# EAGLE schematic hometech++ (EAGLE 5.11)
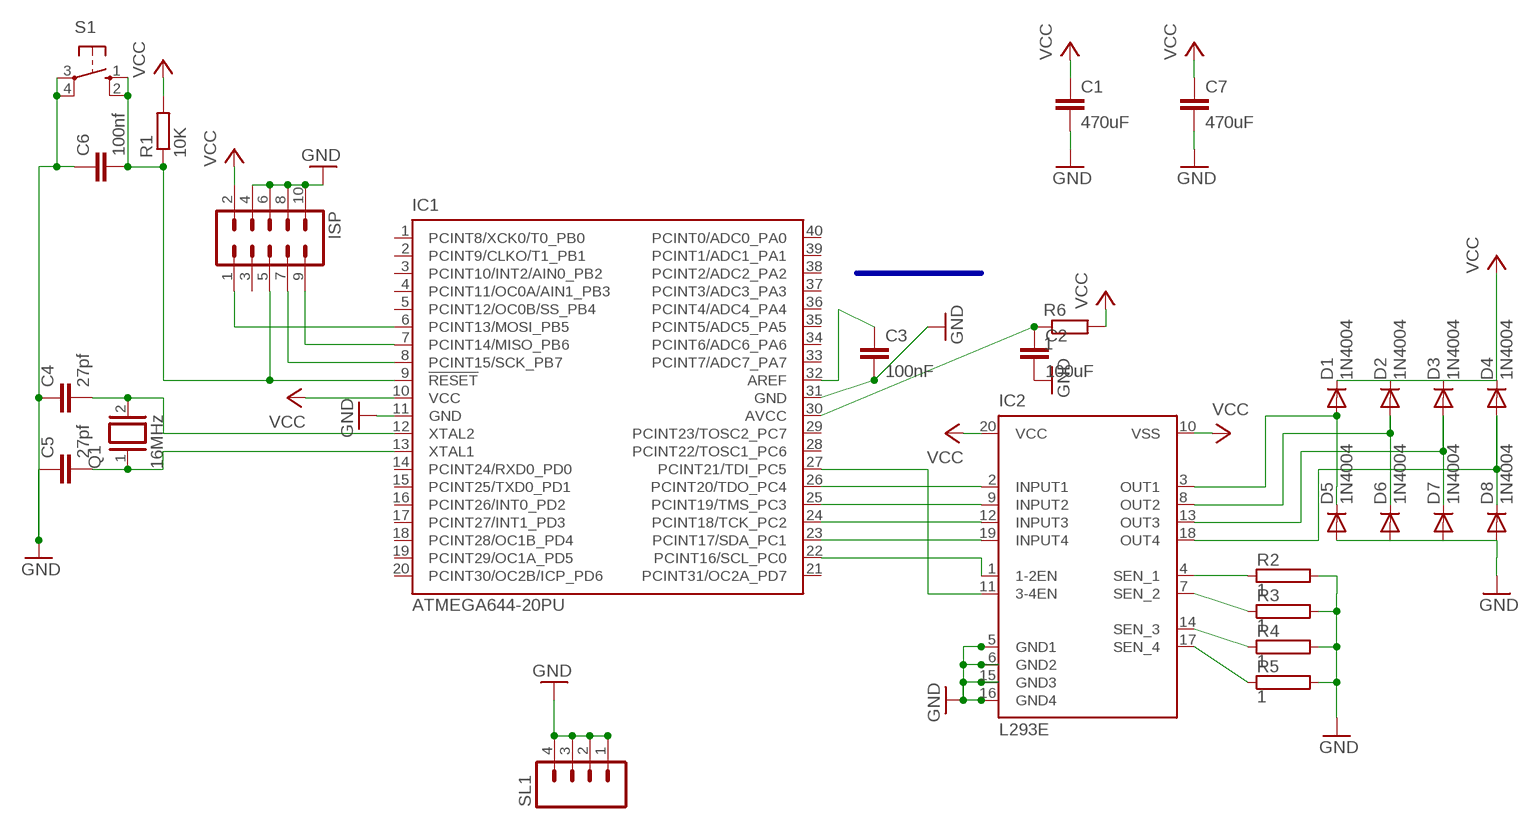
[diagram p0: schematic, sheet 1]

## Parts
C1  470uF  C7.5/3  [C7.5B3]
C2  100uF  C2,5-3  [C2.5-3]
C3  100nF  C2,5-3  [C2.5-3]
C4  27pf  C2,5-3  [C2.5-3]
C5  27pf  C2,5-3  [C2.5-3]
C6  100nf  C2,5-3  [C2.5-3]
C7  470uF  C7.5/3  [C7.5B3]
D1  1N4004  [DO41-10]
D2  1N4004  [DO41-10]
D3  1N4004  [DO41-10]
D4  1N4004  [DO41-10]
D5  1N4004  [DO41-10]
D6  1N4004  [DO41-10]
D7  1N4004  [DO41-10]
D8  1N4004  [DO41-10]
IC1  ATMEGA644-20PU  [DIL40]
IC2  L293E  [DIL20]
ISP  ML10  [ML10]
Q1  16MHz  XTAL/S  [QS]
R1  10K  R-EU_0204/7  [0204/7]
R2  1  RAC01  [AC01]
R3  1  RAC01  [AC01]
R4  1  RAC01  [AC01]
R5  1  RAC01  [AC01]
R6  1  R-EU_0204/2V  [0204V]
S1  10-XX  [B3F-10XX]
SL1  MA04  [04PA]

## Nets
GND: C1.2 C2.2 C3.2 C4.1 C5.1 C6.1 C7.2 D5.A D6.A D7.A D8.A IC1.11(GND) IC1.31(GND) IC2.5(GND1) IC2.6(GND2) IC2.15(GND3) IC2.16(GND4) ISP.4 ISP.6 ISP.8 ISP.10 R2.2 R3.2 R4.2 R5.2 S1.3(P) S1.4(P1) SL1.1 SL1.2 SL1.3 SL1.4
N$1: IC1.23(PCINT17/SDA_PC1) IC2.19(INPUT4)
N$2: IC1.24(PCINT18/TCK_PC2) IC2.12(INPUT3)
N$3: IC1.22(PCINT16/SCL_PC0) IC2.1(1-2EN)
N$4: IC1.25(PCINT19/TMS_PC3) IC2.9(INPUT2)
N$5: IC1.6(PCINT13/MOSI_PB5) ISP.1
N$6: C6.2 IC1.9(!RESET) ISP.5 R1.1 S1.1(S) S1.2(S1)
N$7: IC1.7(PCINT14/MISO_PB6) ISP.9
N$8: IC1.27(PCINT21/TDI_PC5) IC2.11(3-4EN)
N$9: C4.2 IC1.12(XTAL2) Q1.2
N$10: C5.2 IC1.13(XTAL1) Q1.1
N$11: IC1.26(PCINT20/TDO_PC4) IC2.2(INPUT1)
N$12: IC2.4(SEN_1) R2.1
N$13: IC2.7(SEN_2) R3.1
N$14: IC2.14(SEN_3) R4.1
N$15: IC2.17(SEN_4) R5.1
N$17: C2.1 IC1.30(AVCC) R6.1
N$18: IC1.8(PCINT15/SCK_PB7) ISP.7
N$19: D1.A D5.C IC2.3(OUT1)
N$20: D2.A D6.C IC2.8(OUT2)
N$21: D3.A D7.C IC2.13(OUT3)
N$22: D4.A D8.C IC2.18(OUT4)
N$23: C3.1 IC1.32(AREF)
VCC: C1.1 C7.1 D1.C D2.C D3.C D4.C IC1.10(VCC) IC2.10(VSS) IC2.20(VCC) ISP.2 R1.2 R6.2
Unconnected: IC1.1(PCINT8/XCK0/T0_PB0) IC1.2(PCINT9/CLKO/T1_PB1) IC1.3(PCINT10/INT2/AIN0_PB2) IC1.4(PCINT11/OC0A/AIN1_PB3) IC1.5(PCINT12/OC0B/SS_PB4) IC1.14(PCINT24/RXD0_PD0) IC1.15(PCINT25/TXD0_PD1) IC1.16(PCINT26/INT0_PD2) IC1.17(PCINT27/INT1_PD3) IC1.18(PCINT28/OC1B_PD4) IC1.19(PCINT29/OC1A_PD5) IC1.20(PCINT30/OC2B/ICP_PD6) IC1.21(PCINT31/OC2A_PD7) IC1.28(PCINT22/TOSC1_PC6) IC1.29(PCINT23/TOSC2_PC7) IC1.33(PCINT7/ADC7_PA7) IC1.34(PCINT6/ADC6_PA6) IC1.35(PCINT5/ADC5_PA5) IC1.36(PCINT4/ADC4_PA4) IC1.37(PCINT3/ADC3_PA3) IC1.38(PCINT2/ADC2_PA2) IC1.39(PCINT1/ADC1_PA1) IC1.40(PCINT0/ADC0_PA0) ISP.3

## Buses
ADC_CON:PA1,PA2,PA3,PA4

## Library data of the parts
C1-C7 = capacitor-wima:C: CAPACITOR naming: grid - package width
D1-D8 = diode:1N4004: DIODE general purpose rectifier, 1 A
IC1 = atmel:ATMEGA644-*PU: 8-bit Microcontroller with 64K Bytes In-System Programmable Flash Auto generated by make-symbol-device-package-bsdl.ulp Rev. 34 Source: http://www.atmel.com/dyn/resources/prod_documents/doc2593.pdf
IC2 = l293e:L293E: PUSH-PULL 4 CHANNEL DRIVER
ISP = con-harting-ml:ML10: HARTING
Q1 = special:XTAL/S: CRYSTAL
R1 R6 = resistor:R-EU_: RESISTOR, European symbol
R2-R5 = resistor-power:R: Power Resitor; OC_FARNELL: unknown; OC_NEWARK: unknown
S1 = switch-omron:10-XX: OMRON SWITCH
SL1 = con-amp-quick:MA04: AMP QUICK CONNECTOR